# EAGLE schematic 2-layer-cpwg (EAGLE 9.4.1)
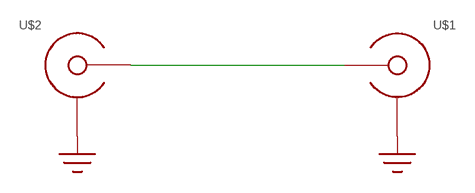
[diagram p0: schematic, sheet 1]

## Parts
U$1  SMA-EDGE-LAUNCH  [SMA_EDGE_LAUNCH_2L_4020_TAPER]
U$2  SMA-EDGE-LAUNCH  [SMA_EDGE_LAUNCH_2L_4020_TAPER]

## Nets
GND: U$1.BOTTOM_GND(SHIELD) U$1.GND@1(SHIELD) U$1.GND@2(SHIELD) U$1.GND@3(SHIELD) U$1.GND@4(SHIELD) U$1.GND@5(SHIELD) U$1.GND@6(SHIELD) U$1.GND@7(SHIELD) U$1.GND@8(SHIELD) U$1.GND@14(SHIELD) U$1.GND@15(SHIELD) U$1.GND@16(SHIELD) U$1.GND@17(SHIELD) U$1.GND_PAD1(SHIELD) U$1.GND_PAD2(SHIELD) U$1.P$1(SHIELD) U$1.P$2(SHIELD) U$2.BOTTOM_GND(SHIELD) U$2.GND@1(SHIELD) U$2.GND@2(SHIELD) U$2.GND@3(SHIELD) U$2.GND@4(SHIELD) U$2.GND@5(SHIELD) U$2.GND@6(SHIELD) U$2.GND@7(SHIELD) U$2.GND@8(SHIELD) U$2.GND@14(SHIELD) U$2.GND@15(SHIELD) U$2.GND@16(SHIELD) U$2.GND@17(SHIELD) U$2.GND_PAD1(SHIELD) U$2.GND_PAD2(SHIELD) U$2.P$1(SHIELD) U$2.P$2(SHIELD)
N$1 [50-ohm]: U$1.CENTER@1(CENTER) U$2.CENTER@1(CENTER)

## Library data of the parts
U$1 U$2 = sma_footprint_2l:SMA-EDGE-LAUNCH

## Net classes
1 50-ohm: width 0.775 mm, clearance 0.152 mm